# Altium schematic sheet FPGA_Memec_SpartanII_DemoBoard_Rev3.SchDoc: Example for Memec Spartan II Demo Board R3
size B; DocumentNumber: 1; SheetNumber: 1; SheetTotal: 2; Address1: L3, 12a Rodborough Rd; Address2: Frenchs Forest; Address3: NSW; Address4: Australia 2086; Organization: Altium Limited
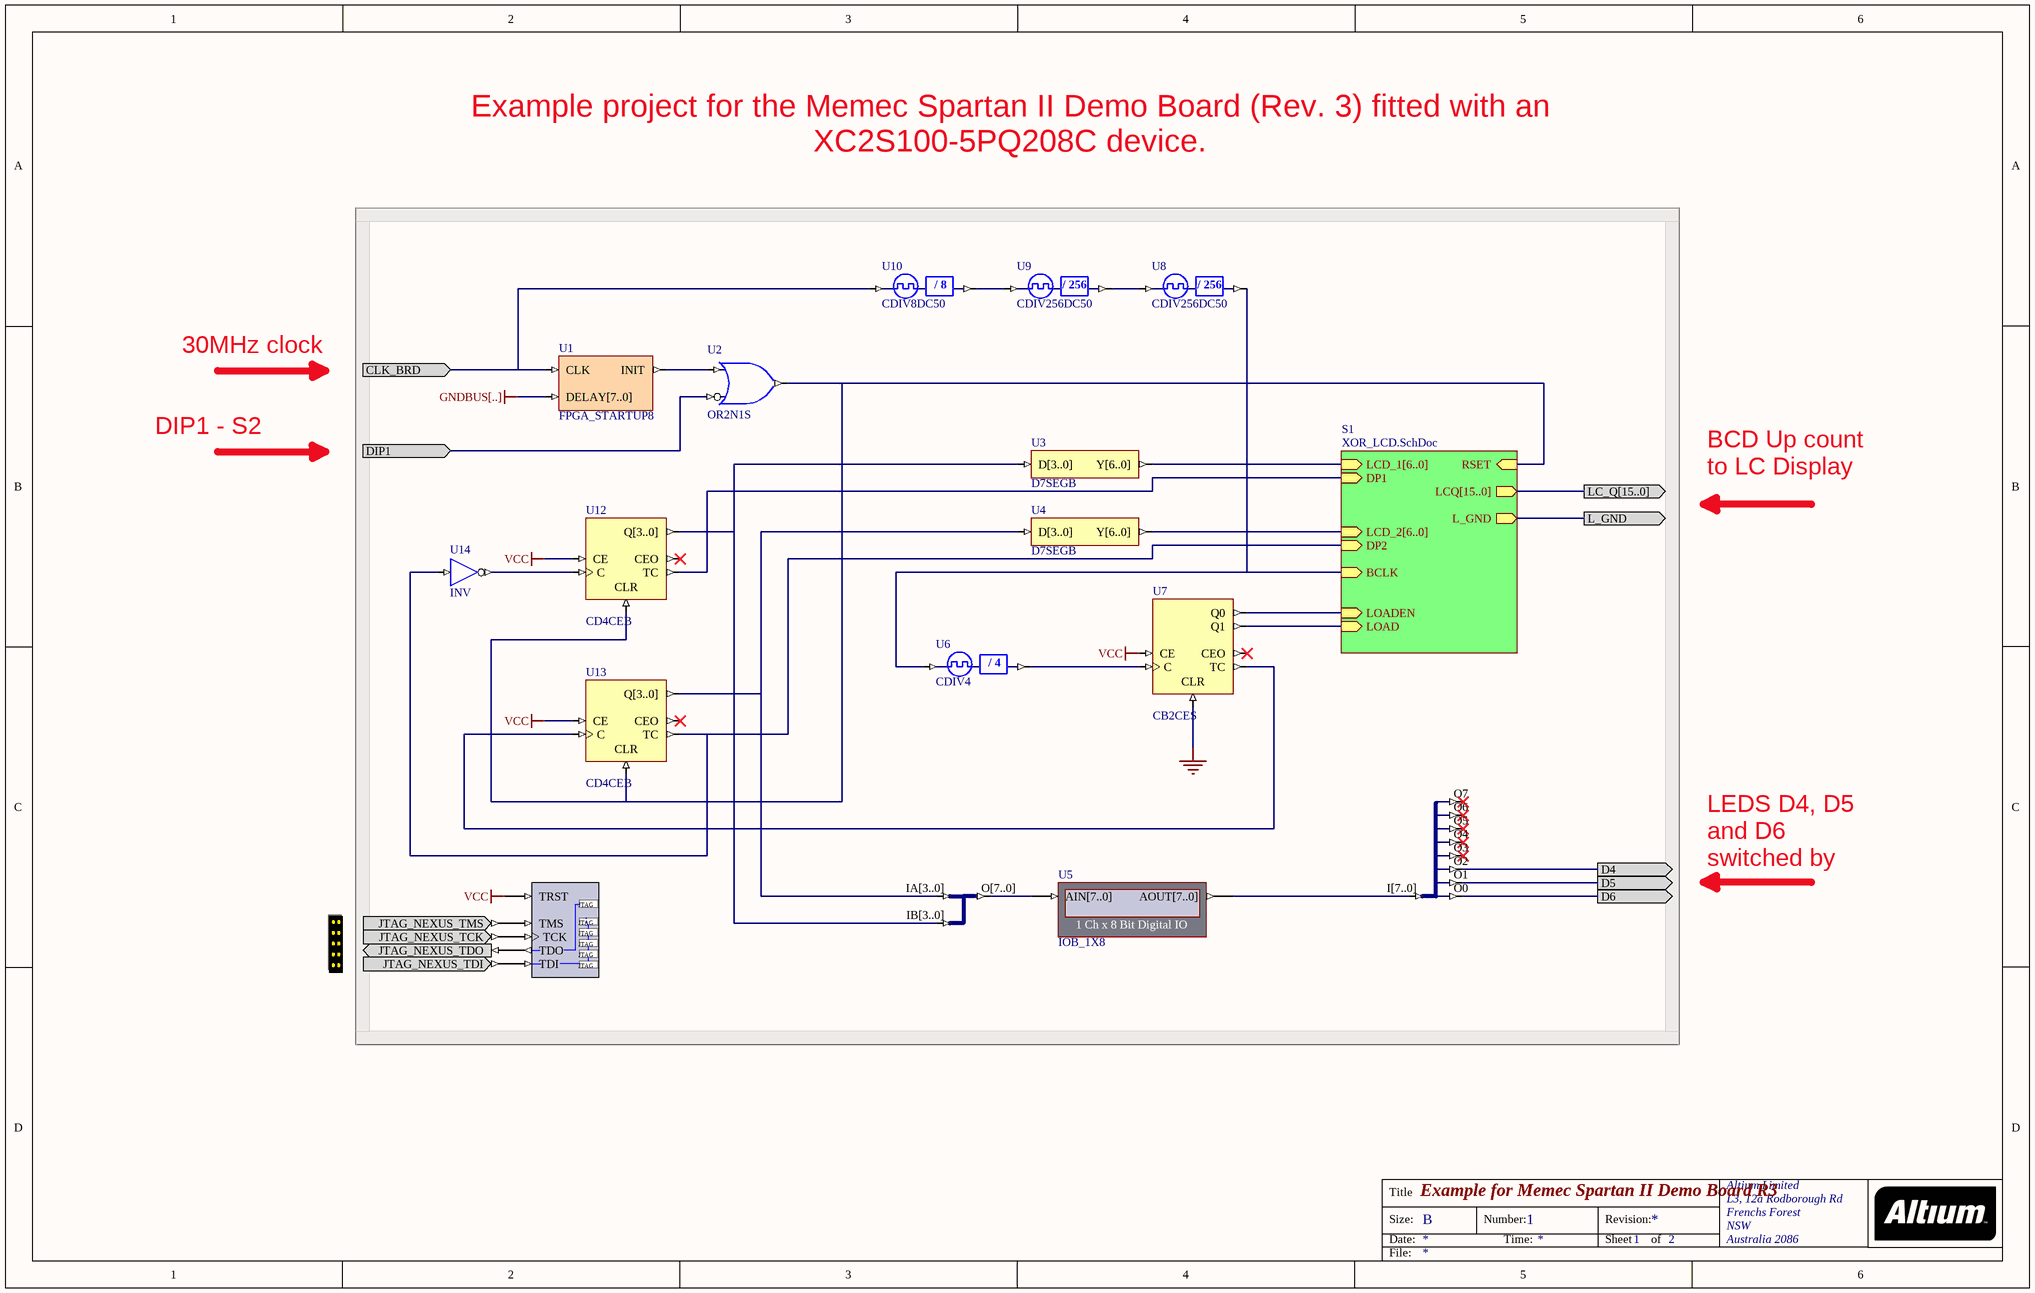
[diagram p0: FPGA_Memec_SpartanII_DemoBoard_Rev3.SchDoc]

## Parts
?  NEXUS_JTAG_CONNECTOR  (value not drawn)
NEXUS_JTAG_PORT  NEXUS_JTAG_PORT  (value not drawn)
U1  FPGA_STARTUP8
U2  OR2N1S
U3  D7SEGB
U4  D7SEGB
U5  IOB_1X8
U6  CDIV4
U7  CB2CES
U8  CDIV256DC50
U9  CDIV256DC50
U10  CDIV8DC50
U11  J4B2_8B  (value not drawn)
U12  CD4CEB
U13  CD4CEB
U14  INV
U15  J8B_8S  (value not drawn)

## Sub-sheets
S1 = XOR_LCD.SchDoc: LCD_1[6..0] (in), LOADEN (in), LCQ[15..0] (out), L_GND (out), BCLK (in), LOAD (in), RSET (in), LCD_2[6..0] (in), DP1 (in), DP2 (in)

## Ports
CLK_BRD (in), D4 (out), D5 (out), D6 (out), DIP1 (in), L_GND (out), LC_Q[15..0] (out)

## Nets
GND: U7.CLR
GNDBUS[..]: U1.DELAY[7..0]
VCC: NEXUS_JTAG_PORT.TRST U7.CE U12.CE U13.CE
CLK_BRD: U1.CLK U10.CLKIN ; port CLK_BRD
D4: U15.O2 ; port D4
D5: U15.O1 ; port D5
D6: U15.O0 ; port D6
DIP1: U2.I0 ; port DIP1
L_GND: port L_GND, sheet S1/L_GND
Net?_JTAG_NEXUS_TCK: ?.JTAG_NEXUS_TCK NEXUS_JTAG_PORT.TCK
Net?_JTAG_NEXUS_TDI: ?.JTAG_NEXUS_TDI NEXUS_JTAG_PORT.TDI
Net?_JTAG_NEXUS_TDO: ?.JTAG_NEXUS_TDO NEXUS_JTAG_PORT.TDO
Net?_JTAG_NEXUS_TMS: ?.JTAG_NEXUS_TMS NEXUS_JTAG_PORT.TMS
NetU1_INIT: U1.INIT U2.I1
NetU2_O: U2.O U12.CLR U13.CLR ; sheet S1/RSET
NetU3_D[3..0]: U3.D[3..0] U11.IB[3..0] U12.Q[3..0]
NetU3_Y[6..0]: U3.Y[6..0] ; sheet S1/LCD_1[6..0]
NetU4_D[3..0]: U4.D[3..0] U11.IA[3..0] U13.Q[3..0]
NetU4_Y[6..0]: U4.Y[6..0] ; sheet S1/LCD_2[6..0]
NetU5_AIN[7..0]: U5.AIN[7..0] U11.O[7..0]
NetU5_AOUT[7..0]: U5.AOUT[7..0] U15.I[7..0]
NetU6_CLKDV: U6.CLKDV U7.C
NetU6_CLKIN: U6.CLKIN U8.CLKDV ; sheet S1/BCLK
NetU7_Q0: U7.Q0 ; sheet S1/LOADEN
NetU7_Q1: U7.Q1 ; sheet S1/LOAD
NetU7_TC: U7.TC U13.C
NetU8_CLKIN: U8.CLKIN U9.CLKDV
NetU9_CLKIN: U9.CLKIN U10.CLKDV
NetU12_C: U12.C U14.O
NetU12_TC: U12.TC ; sheet S1/DP1
NetU13_TC: U13.TC U14.I ; sheet S1/DP2

Not connected (* = marked no-connect by the designer): U7 CEO*; U12 CEO*; U13 CEO*; U15 O3* O4* O5* O6* O7*

## Buses and harness runs
bus port LC_Q[15..0] = sheet S1/LCQ[15..0]

## Notes on the sheet
- Example project for the Memec Spartan II Demo Board (Rev. 3) fitted with an XC2S100-5PQ208C device.
- 30MHz clock
- DIP1 - S2 (Reset)
- BCD Up count to LC Display
- LEDS D4, D5 and D6 switched by SOFT Digital IO
- Title
- Size:
- Date:
- B
- Number:
- Time:
- Revision:
- Sheet
- of
- File:
- (in symbol CDIV4) / 4
- (in symbol CDIV8DC50) / 8
- (in symbol CDIV256DC50) / 256
- (in symbol NEXUS_JTAG_PORT) .

## Library data of the parts
? = NEXUS_JTAG_CONNECTOR: JTAG Port; PortComponent: True; Published: 19-Nov-2003; Publisher: Altium Limited
NEXUS_JTAG_PORT = NEXUS_JTAG_PORT: Soft Nexus-Chain Connector; NEXUS_JTAG_CONNECTOR: True; FunctionalClass: JTAG; Published: 29-Jan-2004; Publisher: Altium Limited; LastRevisionNo: 1.00.00; HelpURL: CR0118 FPGA Generic Library Guide.pdf#page=399
U1 = FPGA_STARTUP8: FPGA Startup With 8 Bit Delay; Published: 21/01/2004; Publisher: Altium Hobart Technology Centre; Core Revision: 1.00.00
U2 = OR2N1S: 2-Input OR Gate with Active Low A Input, Single Pin Version; XilinxEquivalent: OR2B1; FunctionalClass: Logic Primitive; PortSize: 2; ArchiveName: GENERIC; VHDLIB_SIM: GENERIC_LIB; Published: 29-Jan-2004; Publisher: Altium Limited; LastRevisionNo: 1.00.00; HelpURL: CR0118 FPGA Generic Library Guide.pdf#page=404; SubClass: OR; PortStyle: Single Pin Version
U3 U4 = D7SEGB: 7-Segment-Display Decoder for Common-Cathode LED (Active High Output), Bus Version; SubClass: 7SEG; PortSize: 7; ArchiveName: GENERIC; VHDLIB_SIM: GENERIC_LIB; Published: 29-Jan-2004; Publisher: Altium Limited; LastRevisionNo: 1.00.00; HelpURL: CR0118 FPGA Generic Library Guide.pdf#page=161; FunctionalClass: Decoder; PortStyle: Bus Version
U5 = IOB_1X8: 1 Ch x 8 Bit Digital IO; NEXUS_CORE: Instrument; NEXUS_JTAG_DEVICE: True; NEXUS_JTAG_ORDER: 0; Published: 30/09/2003; Publisher: Altium Hobart Technology Centre; Core Revision: 1.00.00
U6 = CDIV4: Clock Divider by 4; DivisorRate: 4; ArchiveName: GENERIC; VHDLIB_SIM: GENERIC_LIB; Published: 29-Jan-2004; Publisher: Altium Limited; LastRevisionNo: 1.00.00; HelpURL: CR0118 FPGA Generic Library Guide.pdf#page=141; FunctionalClass: Clock Divider
U7 = CB2CES: 2-Bit Cascadable Binary Counters with Clock Enable and Asynchronous Clear, Single Pin Version; XilinxEquivalent: CB2CE; ClockTrigger: Rising; Enable: High; PortSize: 2; ArchiveName: GENERIC; VHDLIB_SIM: GENERIC_LIB; Published: 29-Jan-2004; Publisher: Altium Limited; LastRevisionNo: 1.00.00; HelpURL: CR0118 FPGA Generic Library Guide.pdf#page=127; FunctionalClass: Counter; SubClass: Binary; Reset: Asynchronous; PortType: Single Pin Version
U8 U9 = CDIV256DC50: Clock Divider by 256 with 50% Duty Cycle Output; DivisorRate: 256; DutyCycle: 50; ArchiveName: GENERIC; VHDLIB_SIM: GENERIC_LIB; Published: 29-Jan-2004; Publisher: Altium Limited; LastRevisionNo: 1.00.00; HelpURL: CR0118 FPGA Generic Library Guide.pdf#page=142; FunctionalClass: Clock Divider
U10 = CDIV8DC50: Clock Divider by 8 with 50% Duty Cycle Output; XilinxEquivalent: CLK_DIV8; DivisorRate: 8; DutyCycle: 50; ArchiveName: GENERIC; VHDLIB_SIM: GENERIC_LIB; Published: 29-Jan-2004; Publisher: Altium Limited; LastRevisionNo: 1.00.00; HelpURL: CR0118 FPGA Generic Library Guide.pdf#page=142; FunctionalClass: Clock Divider
U11 = J4B2_8B: 2 x 4-Bit input bus to 1 x 8-bit output bus; FunctionalClass: Bus Joiner; PortSize: 4; ArchiveName: GENERIC; VHDLIB_SIM: GENERIC_LIB; Published: 29-Jan-2004; Publisher: Altium Limited; LastRevisionNo: 1.00.00; HelpURL: CR0118 FPGA Generic Library Guide.pdf#page=301
U12 U13 = CD4CEB: Cascadable BCD Counter with Clock Enable and Asynchronous Clear, Bus Version; ClockTrigger: Rising; Enable: High; PortSize: 4; ArchiveName: GENERIC; VHDLIB_SIM: GENERIC_LIB; Published: 29-Jan-2004; Publisher: Altium Limited; LastRevisionNo: 1.00.00; HelpURL: CR0118 FPGA Generic Library Guide.pdf#page=137; FunctionalClass: Counter; SubClass: BCD; Reset: Asynchronous; PortType: Bus Version
U14 = INV: Inverter; FunctionalClass: Logic Primitive; ArchiveName: GENERIC; VHDLIB_SIM: GENERIC_LIB; Published: 29-Jan-2004; Publisher: Altium Limited; XilinxEquivalent: INV; LastRevisionNo: 1.00.00; HelpURL: CR0118 FPGA Generic Library Guide.pdf#page=290; SubClass: INV
U15 = J8B_8S: 8-Bit input bus to 8 single pin outputs; FunctionalClass: Bus Joiner; PortSize: 8; ArchiveName: GENERIC; VHDLIB_SIM: GENERIC_LIB; Published: 29-Jan-2004; Publisher: Altium Limited; LastRevisionNo: 1.00.00; HelpURL: CR0118 FPGA Generic Library Guide.pdf#page=303